# Altium schematic sheet raumluftsensor.SchDoc
size A4; DocumentNumber: 1; Revision: 0.1; SheetNumber: 1; SheetTotal: 1; HTL_Gruppe: I; HTL_Klasse: Klasse; HTL_Zusaetzlicher_Titel: zusätzlicher Titel; HTL_Schueler_Name: Max Mustermann; PageSetup: Record=PageOptions|CenterHorizontal=True|CenterVertical=True|PrintScale=1.00|XCorrection=1.00|YCorrection=1.00|PrintKind=0|BorderSize=5000000|LeftOffset=0|BottomOffset=0|Orientation=2|PaperLength=1000|PaperWidth=1000|Scale=100|PaperSource=7|PrintQuality=-4|MediaType=1|DitherType=10|PaperKind=A4|PrintScaleMode=1; HTL_Projektname: Projektname; HTL_Dokumentenart: Dokumentenart; HTL_Dokumentenstatus: Dokumentenstatus
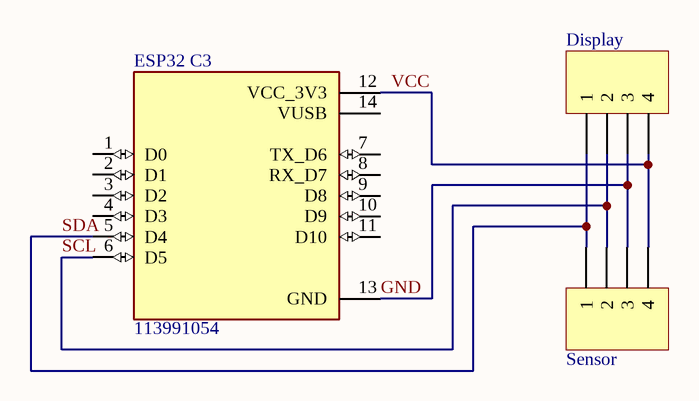
[diagram p0: raumluftsensor.SchDoc]

## Parts
Display  Header 4  [HDR1X4]  (value not drawn)
ESP32_C3  113991054  [MODULE_113991054]
Sensor  Header 4  [HDR1X4]  (value not drawn)

## Nets
GND: Display.3 ESP32_C3.13(GND) Sensor.3
SCL: Display.2 ESP32_C3.6(D5) Sensor.2
SDA: Display.1 ESP32_C3.5(D4) Sensor.1
VCC: Display.4 ESP32_C3.12(VCC_3V3) Sensor.4

Not connected (* = marked no-connect by the designer): ESP32_C3 1(D0) 2(D1) 3(D2) 4(D3) 7(TX_D6) 8(RX_D7) 9(D8) 10(D9) 11(D10) 14(VUSB)

## Notes on the sheet
- Sachnummer / Dateiname:
- Name:
- Gruppe:
- Klasse:
- Elektronik &
- Technische Informatik
- Anichstraße 26 - 28
- HTBLVA
- Titel:
- Datum:
- Dokumentenart:
- Dokumentenstatus:
- A - 6020 Innsbruck
- Ver.:
- Blatt:
- Blätter:

## Library data of the parts
Display Sensor = Header 4: Header, 4-Pin; LatestRevisionDate: 17-Jul-2002; LatestRevisionNote: Re-released for DXP Platform.; Publisher: Altium Limited
ESP32_C3 = 113991054: - ESP32-C3 Transceiver; 802.11 a/b/g/n (Wi-Fi, WiFi, WLAN), BluetoothÂ® Smart 4.x Low Energy (BLE) 2.4GHz Evaluation Board; MF: Seeed Technology Co., Ltd; SnapEDA_Link: https://www.snapeda.com/parts/113991054/Seeed+Studio/view-part/?ref=snap; Package: None; Value: *; MP: 113991054; Check_prices: https://www.snapeda.com/parts/113991054/Seeed+Studio/view-part/?ref=eda